# EAGLE design MAX31865_Layout_with_OLED (EAGLE 7.4.0)
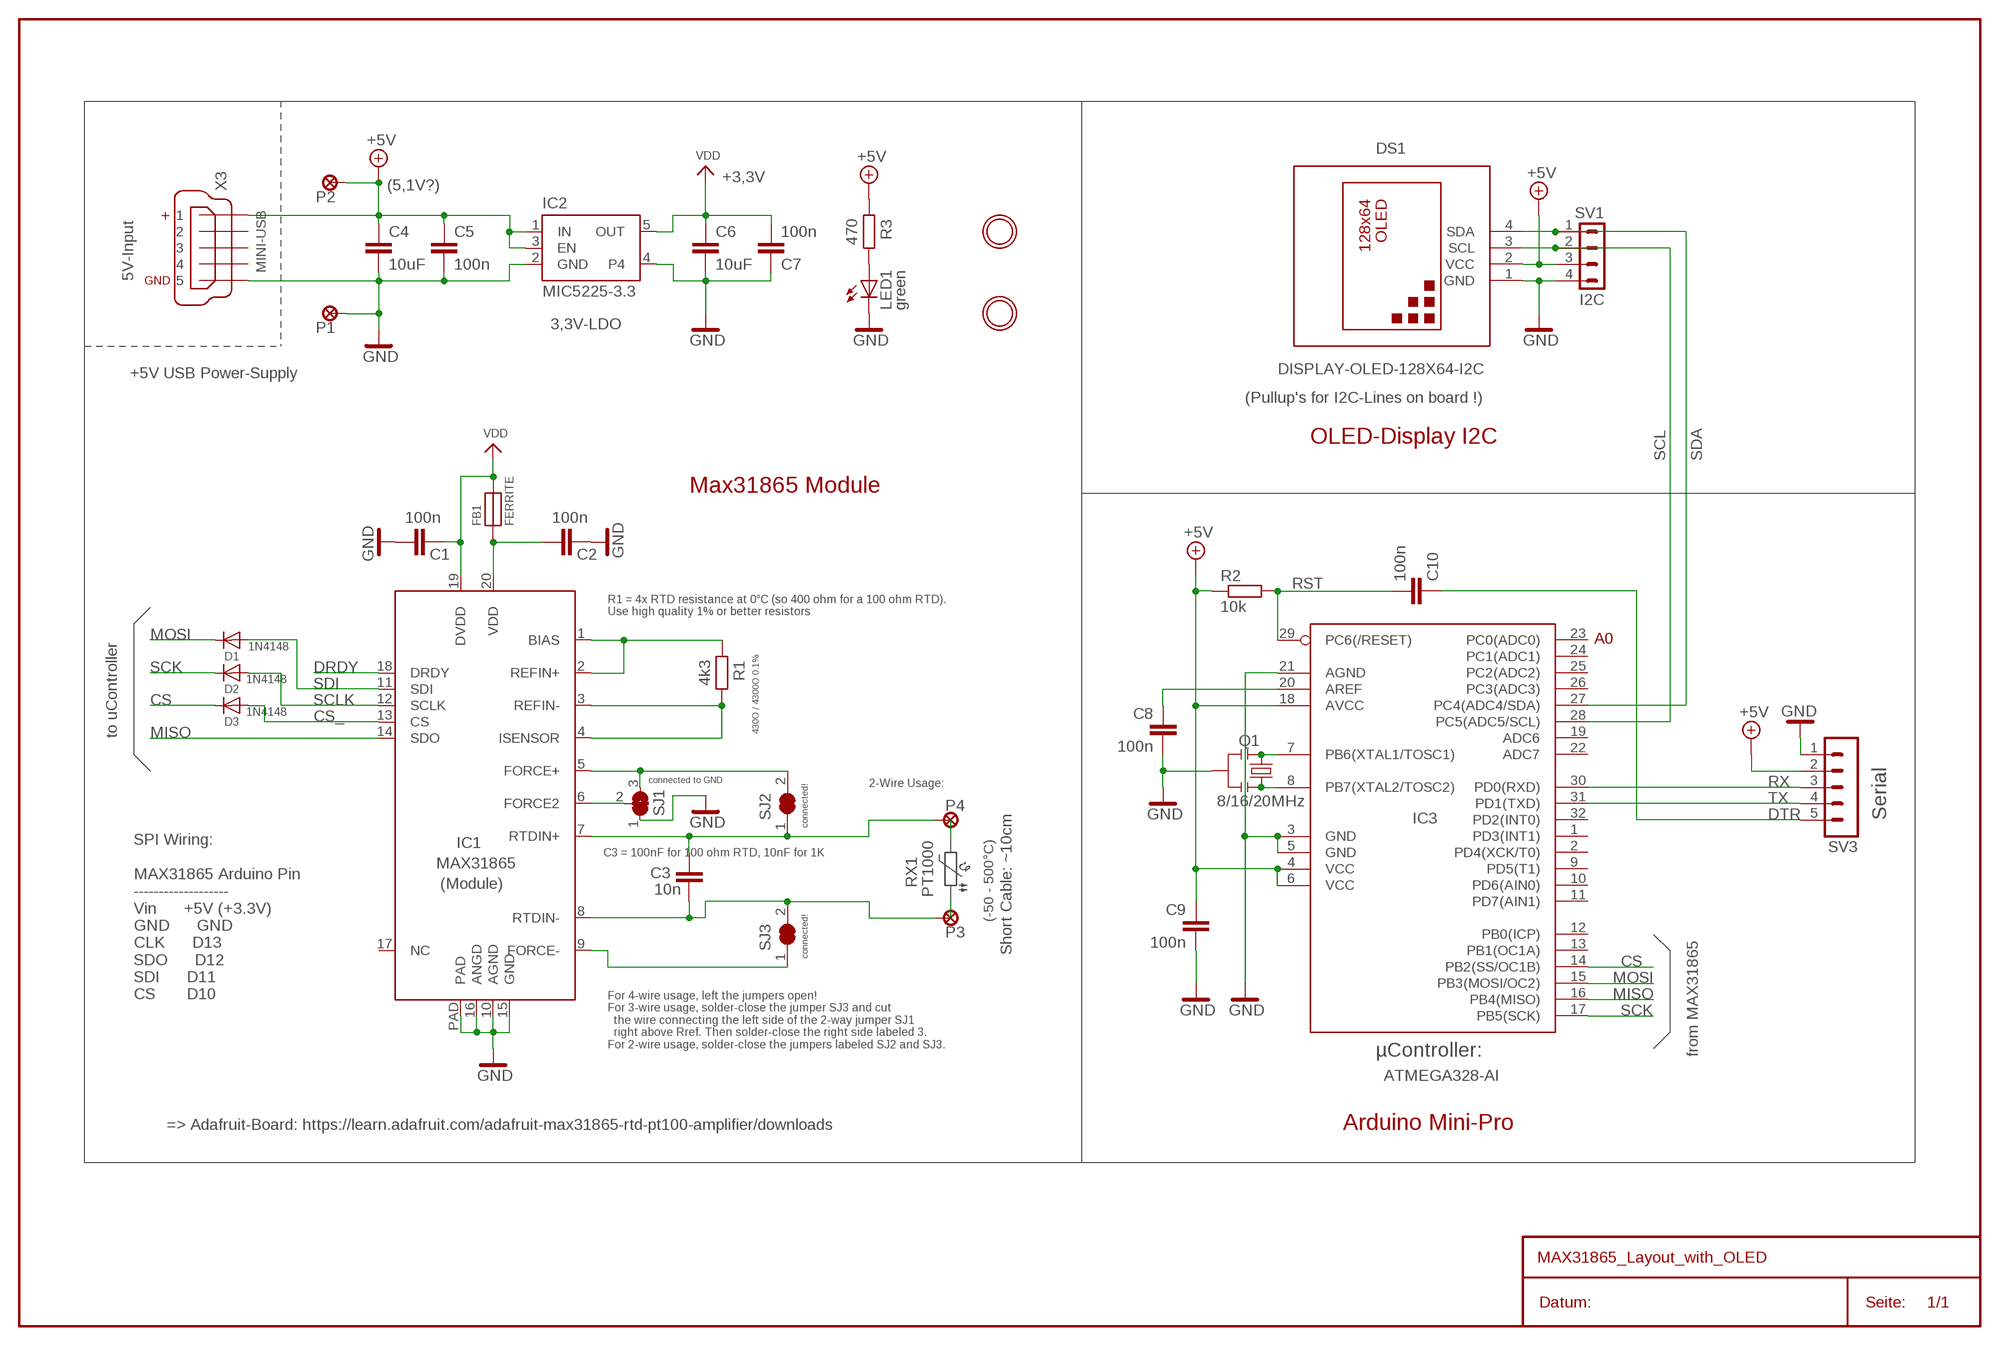
[diagram p0: schematic, sheet 1]

## Parts
C1  100n  C-EUC0603  [C0603]
C2  100n  C-EUC0603  [C0603]
C3  10n  C-EUC0603  [C0603]
C4  10uF  C-EUC0805  [C0805]
C5  100n  C-EUC0603  [C0603]
C6  10uF  C-EUC0603  [C0603]
C7  100n  C-EUC0603  [C0603]
C8  100n  C-EUC0603  [C0603]
C9  100n  C-EUC0603  [C0603]
C10  100n  C-EUC0603  [C0603]
D1  1N4148  DIODESOD-323  [SOD-323]
D2  1N4148  DIODESOD-323  [SOD-323]
D3  1N4148  DIODESOD-323  [SOD-323]
DS1  DISPLAY-OLED-128X64-I2C  [DISPLAY-OLED-128X64-I2C]
FB1  FERRITE  [0603]
IC1  MAX31865  TEMP_MAX31865  [QFN20_4MM_0.65MM]
IC2  MIC5225-3.3  VREG_SOT23-5  [SOT23-5]
IC3  ATMEGA328-AI  MEGA8-AI  [TQFP32-08]
LED1  green  LEDCHIPLED_0805  [CHIPLED_0805]
P1  LSP15  [LSP15]
P2  LSP15  [LSP15]
P3  LSP15  [LSP15]
P4  LSP15  [LSP15]
Q1  8/16/20MHz  RESONATOR1:1  [RESONATOR-SMD-1:1]
R1  4k3  R-EU_R0603  [R0603]
R2  10k  R-EU_R0603  [R0603]
R3  470  R-EU_R0603  [R0603]
SJ1  SOLDERJUMPER_2WAY  [SOLDERJUMPER_2WAY_OPEN_NOPASTE]
SJ2  SOLDERJUMPER  [SOLDERJUMPER_ARROW_NOPASTE]
SJ3  SOLDERJUMPER  [SOLDERJUMPER_ARROW_NOPASTE]
SV1  I2C  MA04-10  [MA04-1]
SV3  MA05-1  [MA05-1]
U$2  MOUNTINGHOLE2.5  [MOUNTINGHOLE_2.5_PLATED]
U$19  MOUNTINGHOLE2.5  [MOUNTINGHOLE_2.5_PLATED]
X3  MINI-USB  MINI-USB-32005-201  [32005-201]

## Nets
+5V: C4.1 C5.1 C9.1 DS1.2(VCC) IC2.1(IN) IC2.3(EN) IC3.4(VCC) IC3.6(VCC) IC3.18(AVCC) P2.P$1(MP) R2.1 R3.1 SV1.3 SV3.2 X3.1
AREF: C8.1 IC3.20(AREF)
CS: D3.C IC3.14(PB2(SS/OC1B))
CS_: D3.A IC1.13(CS)
DRDY: IC1.18(DRDY)
DTR: C10.1 SV3.5
FORCE2: IC1.6(FORCE2) SJ1.2
FORCE+: IC1.5(FORCE+) SJ1.3 SJ2.2
FORCE-: IC1.9(FORCE-) SJ3.1
GND: C1.2 C2.1 C4.2 C5.2 C6.2 C7.1 C8.2 C9.2 DS1.1(GND) IC1.10(AGND) IC1.15(GND) IC1.16(ANGD) IC1.PAD IC2.2(GND) IC2.4 IC3.3(GND) IC3.5(GND) IC3.21(AGND) LED1.C P1.P$1(MP) Q1.2 SJ1.1 SV1.4 SV3.1 X3.5
MISO: IC1.14(SDO) IC3.16(PB4(MISO))
MOSI: D1.C IC3.15(PB3(MOSI/OC2))
N$1: C2.2 FB1.1 IC1.20(VDD)
N$2: IC1.1(BIAS) IC1.2(REFIN+) R1.1
N$3: IC1.3(REFIN-) IC1.4(ISENSOR) R1.2
N$4: IC3.7(PB6(XTAL1/TOSC1)) Q1.1
N$5: IC3.8(PB7(XTAL2/TOSC2)) Q1.3
N$14: LED1.A R3.2
RST: C10.2 IC3.29(PC6(/RESET)) R2.2
RTDIN+: C3.1 IC1.7(RTDIN+) P4.P$1(MP) SJ2.1
RTDIN-: C3.2 IC1.8(RTDIN-) P3.P$1(MP) SJ3.2
RX: IC3.30(PD0(RXD)) SV3.3
SCK: D2.C IC3.17(PB5(SCK))
SCL: DS1.3(SCL) IC3.28(PC5(ADC5/SCL)) SV1.2
SCLK: D2.A IC1.12(SCLK)
SDA: DS1.4(SDA) IC3.27(PC4(ADC4/SDA)) SV1.1
SDI: D1.A IC1.11(SDI)
TX: IC3.31(PD1(TXD)) SV3.4
VDD: C1.1 C6.1 C7.2 FB1.2 IC1.19(DVDD) IC2.5(OUT)
Unconnected: IC1.17(NC) IC3.1(PD3(INT1)) IC3.2(PD4(XCK/T0)) IC3.9(PD5(T1)) IC3.10(PD6(AIN0)) IC3.11(PD7(AIN1)) IC3.12(PB0(ICP)) IC3.13(PB1(OC1A)) IC3.19(ADC6) IC3.22(ADC7) IC3.23(PC0(ADC0)) IC3.24(PC1(ADC1)) IC3.25(PC2(ADC2)) IC3.26(PC3(ADC3)) IC3.32(PD2(INT0)) X3.2 X3.3 X3.4

## Notes on the sheet
- +3,3V
- (5,1V?)
- 5V-Input
- 3,3V-LDO
- +5V USB Power-Supply
- (Pullup's for I2C-Lines on board !)
- OLED-Display I2C
- Max31865 Module
- R1 = 4x RTD resistance at 0°C (so 400 ohm for a 100 ohm RTD).
  Use high quality 1% or better resistors
- A0
- 430O / 4300O 0.1%
- to uController
- connected to GND
- 2-Wire Usage:
- Serial
- connected!
- C3 = 100nF for 100 ohm RTD, 10nF for 1K
- (Module)
- (-50 - 500°C)
- Short Cable: ~10cm
- connected!
- SPI Wiring:
  
  MAX31865 Arduino Pin
  -------------------
  Vin      +5V (+3.3V)
  GND      GND
  CLK      D13
  SDO      D12
  SDI      D11
  CS       D10
- For 4-wire usage, left the jumpers open!
  For 3-wire usage, solder-close the jumper SJ3 and cut
    the wire connecting the left side of the 2-way jumper SJ1
    right above Rref. Then solder-close the right side labeled 3.
  For 2-wire usage, solder-close the jumpers labeled SJ2 and SJ3.
- µController: | from MAX31865
- => Adafruit-Board: https://learn.adafruit.com/adafruit-max31865-rtd-pt100-amplifier/downloads | Arduino Mini-Pro

## Library data of the parts
C1-C10 = rcl1:C-EU: CAPACITOR, European symbol
D1-D3 = microbuilder:DIODE: Diode SMA Model Volts Amps Type Vf Ir Digikey # Notes SSA34-E3 40V 3A Schottky 480mV @ 3A 200uA @ 40V SSA34-E3/61TGITR-ND CDBA120-G 20V 1A Schottky 500mV @ 1A 500uA @ 20V 641-1014-6-ND REEL MBRA210 10V 2A Schottky 350mV @ 2A 700uA @ 10V MBRA210LT3 SOD-123 Model Volts Amps Type Vf Ir Order # Notes BAT54T1G 30V 200mA Schottky 800mV @ 200mA 2uA @ 25V BAT54T1GOSTR-ND B0530W 30V 500mA Schottky 430mV @ 500mA 130uA @ 30V B0530W-FDICT-ND REEL MBR120 20V 1A Schottky 340mV @ 1A MBR120VLSFT1GOSCT-ND SOD-323 Model Volts Amps Type Vf Ir Order # Notes PMEG2005EJ 20V 500mA Schottky 355mV @ 500mA 568-4110-1-ND ZLLS410 10V 570mA Schottky 380mV @ 570mA ZLLS410CT-ND 1N4148WS 75V 150mA Silicon/Simple 1V 1N4148WSFSCT-ND REEL SOD-523 Model Volts Amps Type Vf Ir Order # Notes BAT54XV2 30V 200mA Schottky 0.8V @ 100mA BAT54XV2CT-ND TB751S 30V 30mA Schottky RB751S-40TE61CT-ND SOT23-R/W (R = Solder Paste/Reflow Ovens, W = Hand-Soldering) Model Volts Amps Type Vf Ir Order # Notes BAT54FILM 40V 300mA Schottky 497-7162-1-ND POWERDI-5 Model Volts Amps Type Vf Ir Order # Notes PDS560 60V 5A Schottky 670mV @ 5A 150uA @ 60V PDS560DICT-ND
DS1 = diy-modules:DISPLAY-OLED-128X64-I2C: 128x64 Dot Matrix OLED Module based on SSD1306 chip Variant with I2C interface More details available here: http://www.instructables.com/id/Monochrome-096-i2c-OLED-display-with-arduino-SSD13/ SSD1306 datasheet: https://cdn-shop.adafruit.com/datasheets/SSD1306.pdf Click here to find device on ebay.com <http://www.ebay.com/sch/oled+display+128x64+iic> Note: There are two variants: I2C and SPI. Search for the proper version.
FB1 = microbuilder:FERRITE: Ferrite Bead 0603 MMZ1608B121C - 120 Ohm, 600mA Ferrite Chip - Digikey: 445-2164-1-ND BK1608HW121-T - 120 Ohm, 600mA Ferrite Chip - Digikey: 587-1876-2-ND 0805 HZ0805B272R-10 - 2.7K Ohm @ 100MHz, 200mA 0.8 Ohm DC Resistance - Digikey: 240-2504-1-ND (see also Murata BLM21BD272SN1L)
IC1 = microbuilder:TEMP_MAX31865: MAX31865 - Resistance to Digital Convertor for Platinum Resistance Temperature Detectors (RTDs) Handles 100 ohm - 1K ohm (at 0°C) platinum RTDs. 15-bit ADC resolution (nominally 0.03125°C), 0.5°C accuracy.
IC2 = microbuilder:VREG_SOT23-5: SOT23-5 Fixed Voltage Regulators Part Current Out V Out V In V Dropout θJA (°C/W) TJ (°C) Digikey Part No. ADP121 150mA 3.3V 3.4-5.5V 0.09V @ 150mA -- -- ADP121-AUJZ33R7CT-ND ADP121 150mA 3.0V 3.1-5.5V 0.09V @ 150mA -- -- ADP121-AUJZ30R7CT-ND ADP122 300mA 3.3V 3.4-5.5V 0.085V @ 300mA -- -- ADP122AUJZ-3.3-R7CT-ND ADP1712 300mA 3.3V 3.5-5.5V 0.17V @ 300mA -- -- ADP1712AUJZ-3.3-R7TR-ND AP7311 (Low Cost) 150mA 3.3V 3.5-6V 0.15V @ 150mA -- -- AP7311-33WG-7DICT-ND LD39015M18R 150mA 1.8V 1.9V-5.5V 0.08V @ 100mA -- -- 497-6977-1-ND LP2985A-33DBVR 150mA 3.3V 3.3-16V 0.28V @ 150mA 206 150 296-18479-1-ND MCP1824T-3302E/OT 300mA 3.3V 3.5V-6V 0.2V @ 300mA -- -- MCP1824T-3302E/OTCT-ND MIC5205-2.5YM5 TR 150mA 2.5V 2.7-16V 0.165V @ 150mA -- -- 576-1257-2-ND MIC5205-3.0YM5 TR 150mA 3.0V 3.2V-16V 0.165V @ 150mA -- -- 576-1258-2-ND MIC5205-3.3YM5 TR 150mA 3.3V 3.5V-16V 0.165V @ 150mA -- -- 576-1259-2-ND TPS780330220 150mA 3.3V+2.2V 3.6-5.5V 250mV Max -- -- 296-23332-1-ND TDA3663/N1,135 100mA 3.3V 3.5-45V 0.18V @ 50mA -- -- 568-5343-1-ND Max operating temp can be calculated using θJA, TJ (max junction temperature), and power in watts. Set the "Maximum Ambient Temperature" until it reaches TJ ("Max Junction Temperature"), which is the absolute limit for safe use of the regulator: Heat Sink Temperature Calculator <http://www.daycounter.com/Calculators/Heat-Sink-Temperature-Calculator.phtml> For example, With 12V source into a 3.3V LP2985 and a 30mA load, we are dissipating (12V-3.3V) * 0.03A = 0.261W. With a θJA of 206 °C/W, a TJ of 150°C, and 261mW we can safely use the chip without a heat sink up to 75°C (=147.1°C Junction Temperature).
IC3 = avr-7:MEGA8: MICROCONTROLLER 8 Kbytes FLASH 1 kbytes SRAM 512 bytes EEPROM USART 6-channel 10 bit ADC 2-channel 8 bit ADC
LED1 = led:LED: LED OSRAM: - CHIPLED LG R971, LG N971, LY N971, LG Q971, LY Q971, LO R971, LY R971 LH N974, LH R974 LS Q976, LO Q976, LY Q976 LO Q996 - Hyper CHIPLED LW Q18S LB Q993, LB Q99A, LB R99A - SideLED LS A670, LO A670, LY A670, LG A670, LP A670 LB A673, LV A673, LT A673, LW A673 LH A674 LY A675 LS A676, LA A676, LO A676, LY A676, LW A676 LS A679, LY A679, LG A679 - Hyper Micro SIDELED® LS Y876, LA Y876, LO Y876, LY Y876 LT Y87S - SmartLED LW L88C, LW L88S LB L89C, LB L89S, LG L890 LS L89K, LO L89K, LY L89K LS L896, LA L896, LO L896, LY L896 - TOPLED LS T670, LO T670, LY T670, LG T670, LP T670 LSG T670, LSP T670, LSY T670, LOP T670, LYG T670 LG T671, LOG T671, LSG T671 LB T673, LV T673, LT T673, LW T673 LH T674 LS T676, LA T676, LO T676, LY T676, LB T676, LH T676, LSB T676, LW T676 LB T67C, LV T67C, LT T67C, LS T67K, LO T67K, LY T67K, LW E67C LS E67B, LA E67B, LO E67B, LY E67B, LB E67C, LV E67C, LT E67C LW T67C LS T679, LY T679, LG T679 LS T770, LO T770, LY T770, LG T770, LP T770 LB T773, LV T773, LT T773, LW T773 LH T774 LS E675, LA E675, LY E675, LS T675 LS T776, LA T776, LO T776, LY T776, LB T776 LHGB T686 LT T68C, LB T68C - Hyper Mini TOPLED® LB M676 - Mini TOPLED Santana® LG M470 LS M47K, LO M47K, LY M47K Source: http://www.osram.convergy.de LUXEON: - LUMILED® LXK2-PW12-R00, LXK2-PW12-S00, LXK2-PW14-U00, LXK2-PW14-V00 LXK2-PM12-R00, LXK2-PM12-S00, LXK2-PM14-U00 LXK2-PE12-Q00, LXK2-PE12-R00, LXK2-PE12-S00, LXK2-PE14-T00, LXK2-PE14-U00 LXK2-PB12-K00, LXK2-PB12-L00, LXK2-PB12-M00, LXK2-PB14-N00, LXK2-PB14-P00, LXK2-PB14-Q00 LXK2-PR12-L00, LXK2-PR12-M00, LXK2-PR14-Q00, LXK2-PR14-R00 LXK2-PD12-Q00, LXK2-PD12-R00, LXK2-PD12-S00 LXK2-PH12-R00, LXK2-PH12-S00 LXK2-PL12-P00, LXK2-PL12-Q00, LXK2-PL12-R00 Source: www.luxeon.com KINGBRIGHT: KA-3528ASYC Source: www.kingbright.com
P1-P4 = solpad-smd:LSP15: SMD Solder-Pad (1.5mm Outer-Ø)
Q1 = Testing:RESONATOR: Resonator Small SMD resonator. This is the itty bitty 10/20MHz resonators with built in caps. CSTCE10M0G55 and CSTCE20M0V53. Footprint for SMD has been used in SFE production for years, and does work okay. 1:1 is an attempt to get larger fillets on the sides so it will be easier to inspect these solders in our AOI machine. The pads have been minimized to match the actual metal under the resonator. To see this relation, it includes an image import of the bottom side of the component. Imported to scale on layer 200.
R1-R3 = rcl1:R-EU_: RESISTOR, European symbol
SJ1 = microbuilder:SOLDERJUMPER_2WAY: 2-Way Solder Jumper
SJ2 SJ3 = microbuilder:SOLDERJUMPER: SMD Solder JUMPER Solder the two pads together to create a connection, or remove the solder to break it. REFLOW - Use this footprint for solder paste and reflow ovens. WAVE - Use this footprint for hand-soldering (larger pads). CLOSED - Has a trace between the two pads to ensure it is closed by default. The trace needs to be cut to disable the jumper, and can be closed again by creating a solder bridge between the two pads.; BOM: EXCLUDE
SV1 = con-lstc:MA04-1: PIN HEADER; OC_FARNELL: unknown; OC_NEWARK: unknown
SV3 = con-lstb:MA05-1: PIN HEADER
U$2 U$19 = microbuilder:MOUNTINGHOLE: Mounting Hole For #2 screws (0.086"/2.18mm width, 0.094"/2.4mm hole) use 2.5mm; BOM: EXCLUDE
X3 = con-cypressindustries:MINI-USB-: MINI USB-B Conector Source: www.cypressindustries.com; OC_FARNELL: unknown; OC_NEWARK: unknown

## Board
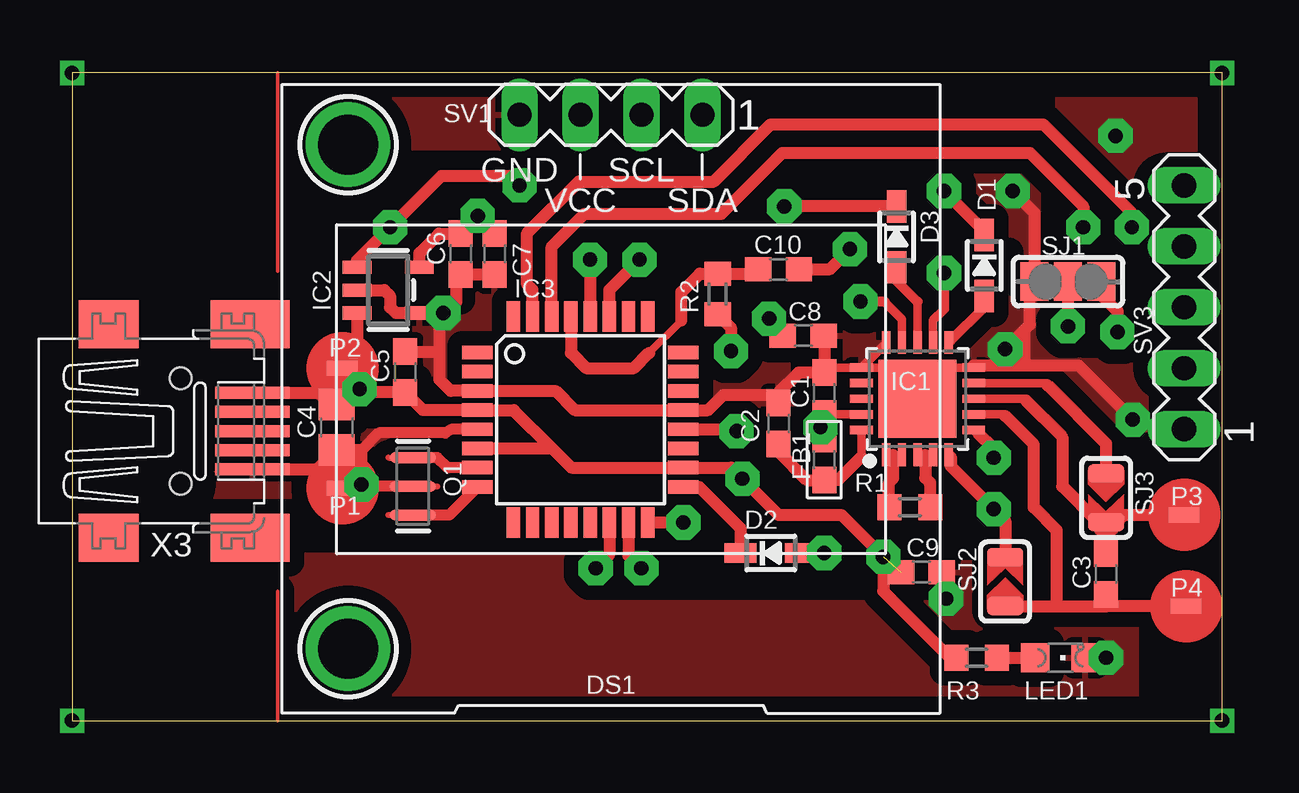
[diagram p1: board, top side]
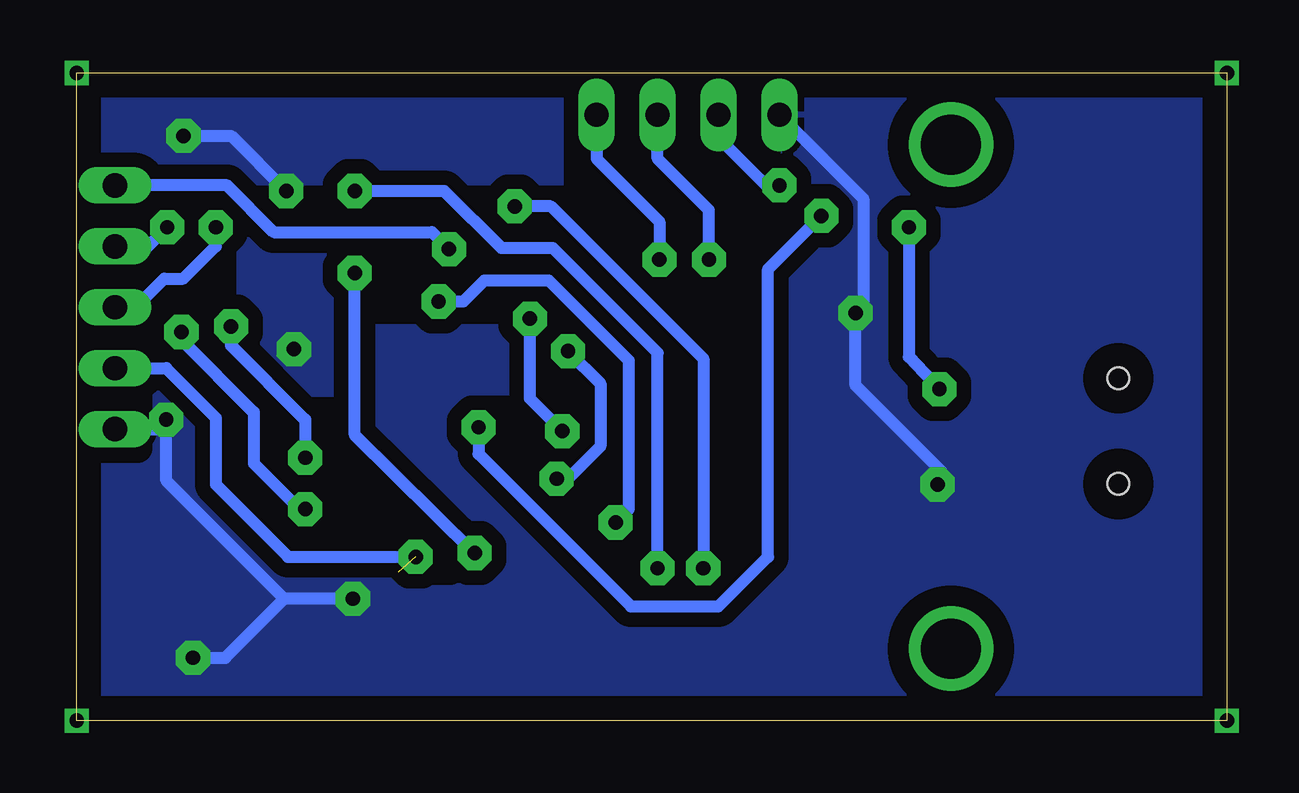
[diagram p2: board, bottom side, seen from below]

Size 47.94 x 26.99 mm. Coordinates in mm from the lower left corner, seen from the top.
Outline: 0,0 47.94,0 47.94,26.99 0,26.99 0,0
Copper layers (1*16): Top 0.035mm / dielectric 1.5mm / Bottom 0.035mm
Design rules "default": minimum track width 10mil, minimum drill 24mil, track to track 8mil, track to pad 8mil, pad to pad 8mil, via to via 8mil, smd to smd 8mil, copper to edge 40mil, drill to drill 8mil, minimum pad ring 10mil, minimum via ring 8mil, stop-mask expansion 4mil, vias tented up to drill 0mil, thermal gap 10mil
tRestrict: area 11.7,17.5 to 16.2,19.1; area 35.8,7.3 to 38.5,9.1; area 22.3,5.6 to 36.1,7.6; area 19.1,23.7 to 20.4,26.1; area 30.6,16.9 to 32.7,18.8; area 30.6,13.7 to 31.5,15.3; area 38.7,18.3 to 39.1,19.5; area 41,19.5 to 42.4,21.8; area 45.5,9.7 to 47.6,14.5; area 43.6,11 to 46,11.4; area 42.2,15.7 to 44.4,16; area 11.8,12.8 to 15,13.7; 7 more areas
bRestrict: area 41.9,17.1 to 43.7,20.4; area 30,17.1 to 35.7,19.6; area 29.6,10.7 to 31,12.9; area 37.1,11.4 to 38.4,12.9; area 45.4,11.4 to 47.1,14; area 32.4,6.3 to 33.9,7.3; area 19.2,23.7 to 21,26.4; area 26.7,20.8 to 41.1,21.7; area 26.5,21.4 to 27,24.4

### Footprints (pad centres in the part's own frame; a part is rotated, then mirrored left to right if it is on the bottom)
C0603 = smd 1.1 x 1: 1 -0.85,0; 2 0.85,0
C0805 = smd 1.3 x 1.5: 1 -0.95,0; 2 0.95,0
SOD-323 = smd 1.35 x 0.8: A 1.27,0; C -1.27,0
DISPLAY-OLED-128X64-I2C = drill 1 square: 1 -3.81,12.7 | drill 1: 2 -1.27,12.7; 3 1.27,12.7; 4 3.81,12.7
0603 = smd 1.1 x 1: 1 -0.85,0; 2 0.85,0
QFN20_4MM_0.65MM = smd 0.35 x 0.95: 1 -1.3,-2.34; 2 -0.65,-2.34; 3 0,-2.34; 4 0.65,-2.34; 5 1.3,-2.34; 11 1.3,2.34; 12 0.65,2.34; 13 0,2.34; 14 -0.65,2.34; 15 -1.3,2.34 | smd 0.95 x 0.35: 6 2.34,-1.3; 7 2.34,-0.65; 8 2.34,0; 9 2.34,0.65; 10 2.34,1.3; 16 -2.34,1.3; 17 -2.34,0.65; 18 -2.34,0; 19 -2.34,-0.65; 20 -2.34,-1.3 | smd 3.25 x 3.25: PAD 0,0
SOT23-5 = smd 0.55 x 1.2: 1 -0.95,-1.3; 2 0,-1.3; 3 0.95,-1.3; 4 0.95,1.3; 5 -0.95,1.3
TQFP32-08 = smd 1.27 x 0.559: 1 -4.293,2.8; 2 -4.293,2; 3 -4.293,1.2; 4 -4.293,0.4; 5 -4.293,-0.4; 6 -4.293,-1.2; 7 -4.293,-2; 8 -4.293,-2.8; 17 4.293,-2.8; 18 4.293,-2; 19 4.293,-1.2; 20 4.293,-0.4; 21 4.293,0.4; 22 4.293,1.2; 23 4.293,2; 24 4.293,2.8 | smd 0.559 x 1.27: 9 -2.8,-4.293; 10 -2,-4.293; 11 -1.2,-4.293; 12 -0.4,-4.293; 13 0.4,-4.293; 14 1.2,-4.293; 15 2,-4.293; 16 2.8,-4.293; 25 2.8,4.293; 26 2,4.293; 27 1.2,4.293; 28 0.4,4.293; 29 -0.4,4.293; 30 -1.2,4.293; 31 -2,4.293; 32 -2.8,4.293
CHIPLED_0805 = smd 1.2 x 1.2: A 0,-1.05; C 0,1.05
LSP15 = smd 1.27 x 0.635: P$1 0,0
RESONATOR-SMD-1:1 = smd 0.45 x 1.905: 1 -1.2,0; 2 0,0; 3 1.2,0
R0603 = smd 1 x 1.1: 1 -0.85,0; 2 0.85,0
SOLDERJUMPER_2WAY_OPEN_NOPASTE = smd 1.168 x 1.6: 1 -1.397,0; 2 0,0; 3 1.397,0
SOLDERJUMPER_ARROW_NOPASTE = smd 0.762 x 1.524: 1 -1.016,0; 2 1.016,0
MA04-1 = drill 0.635 pad 1.524 long: 1 -3.81,0; 2 -1.27,0; 3 1.27,0; 4 3.81,0
MA05-1 = drill 1.016 long: 1 -5.08,0; 2 -2.54,0; 3 0,0; 4 2.54,0; 5 5.08,0
MOUNTINGHOLE_2.5_PLATED = drill 2.5 pad 3.2: P$1 0,0
32005-201 = smd 3.1 x 0.5: 1 3,1.6; 2 3,0.8; 3 3,0; 4 3,-0.8; 5 3,-1.6 | smd 2.5 x 2: M1 -3,-4.45; M2 -3,4.45 | smd 3.3 x 2: M3 2.9,4.45; M4 2.9,-4.45 | hole 0.9: 0,2.2; 0,-2.2

### Placement (x,y rotation side)
C1  31.35,13.65 90 top
C2  29.45,12.38 270 top
C3  43.1,6.11 90 top
C4  11.03,12.22 270 top
C5  13.89,14.53 90 top
C6  16.19,19.45 270 top
C7  17.62,19.45 90 top
C8  30.48,16.03 0 top
C9  35.4,6.19 0 top
C10  29.45,18.81 180 top
D1  38.02,18.97 270 top
D2  29.13,6.99 0 top
D3  34.37,20.16 270 top
DS1  22.46,12.54 0 top
FB1  31.35,10.87 90 top
IC1  35.24,13.41 0 top
IC2  13.18,17.94 270 top
IC3  21.19,12.54 0 top
LED1  41.2,2.62 270 top
P1  11.27,9.68 0 top
P2  11.27,14.68 0 top
P3  46.35,8.57 0 top
P4  46.43,4.76 0 top
Q1  14.21,9.76 270 top
R1  34.92,8.89 0 top
R2  26.91,17.78 90 top
R3  37.7,2.62 0 top
SJ1  41.51,18.3 0 top
SJ2  38.89,5.79 90 top
SJ3  43.1,9.29 270 top
SV1  22.46,25.24 180 top
SV3  46.35,17.22 90 top
U$2  11.5,3 0 top
U$19  11.5,24 0 top
X3  4.52,12.06 0 top

### Tracks (layer width: path | path; a pad name or v marks a point on that pad's centre or on a via)
+5V  (via drill 0.6 pad 1.42)  (1 unrouted)
  Top 0.508: 20,11.35 18.41,12.94 IC3.4 14.62,12.94 C5.1 12.09,13.68 v11.99,13.81 | IC3.6 19.99,11.34 20,11.35 | R2.1 27.46,16.37 v27.46,15.4 | v18.65,22.3 18.26,22.7 15.4,22.7 v13.26,20.56 11.88,19.18 IC2.1 | X3.1 10.22,13.66 C4.1 10.72,13.65 11.19,13.81 | 11.19,13.81 v11.99,13.81 | IC2.3 11.88,14.08 v11.99,13.81 | 20,11.35 20.81,10.54 IC3.18 27.48,10.54 v27.94,10.08 29.45,8.57 32.07,8.57 v33.81,6.83 33.81,5.4 36.59,2.62 R3.1 | P2.P$1 11.27,13.73 11.19,13.81
  Bottom 0.508: SV1.3 21.19,24.29 19.21,22.3 v18.65,22.3 | v27.46,15.4 26.11,14.05 26.11,11.43 27.46,10.08 v27.94,10.08 | SV3.2 44.21,14.68 42.15,12.62 42.15,9.84 39.13,6.83 v33.81,6.83 | v13.26,20.56 13.26,15.16 v11.99,13.81
AREF  (via drill 0.6 pad 1.42)
  Top 0.508: IC3.20 27.62,12.14 v27.7,12.06 | C8.1 29.53,15.95 29.53,16.19 v29.05,16.75
  Bottom 0.508: v27.7,12.06 29.05,13.41 v29.05,16.75
CS  (via drill 0.6 pad 1.42)
  Top 0.508: IC3.14 22.39,6.92 v21.83,6.35 | D3.C v29.69,21.43
  Bottom 0.508: v21.83,6.35 21.83,15.08 28.18,21.43 v29.69,21.43
CS_
  Top 0.356: IC1.13 35.24,17.46
  Top 0.406: 35.24,17.46 34.37,18.34 D3.A
DTR  (via drill 0.6 pad 1.42)
  Top 0.508: C10.1 31.59,18.81 v32.42,19.64
  Bottom 0.508: v32.42,19.64 33.14,20.36 39.73,20.36 41.67,22.3 SV3.5
FORCE2  (via drill 0.6 pad 1.42)
  Top 0.33: IC1.6 37.74,12.03
  Top 0.508: SJ1.2 v41.51,16.43 | 37.74,12.03 38.42,11.35 v38.42,10.95
  Bottom 0.508: v38.42,10.95 38.42,12.54 41.51,15.64 v41.51,16.43
FORCE+  (via drill 0.6 pad 1.42)
  Top 0.33: IC1.5 36.62,10.99
  Top 0.508: 36.62,10.99 36.62,10.61 v38.42,8.81 38.89,8.33 SJ2.2 | SJ1.3 42.91,17.73 43.58,17.07 v43.58,16.19
  Bottom 0.508: v38.42,8.81 38.66,8.81 40.56,10.72 40.56,12.86 43.58,15.88 v43.58,16.19
FORCE-
  Top 0.356: IC1.9 40.66,14.06 40.67,13.97
  Top 0.508: 43.1,10.35 SJ3.1 43.1,11.54 40.67,13.97
GND  (via drill 0.6 pad 1.42)
  Top 0.356: IC1.16 31.57,14.71 | IC1.16 IC1.15 | 33.94,14.71 IC1.16 | 36.54,14.71 IC1.10 37.58,14.8
  Top 0.406: 31.57,14.71 C1.2 | 14.22,9.76 Q1.2 | 12.14,9.76 v12.06,9.84
  Top 0.457: IC3.5 15.8,12.14 15.56,11.99 12.78,11.99 12.07,11.27 | Q1.2 12.14,9.76
  Top 0.508: IC2.2 13.02,17.94 13.26,17.7 13.26,17.22 13.49,16.99 IC2.4 | C7.1 C6.2 16.01,18.89 16.01,17.44 v15.48,16.99 15.32,16.99 15.16,16.99 | 33.94,14.71 IC1.PAD 36.54,14.71 | 29.45,13.65 30.3,14.5 C1.2 31.35,16.01 C8.2 | 29.45,13.65 C2.1 | 29.45,13.65 29.37,13.57 27.15,13.57 26.51,12.94 IC3.21 20.95,12.94 20.15,13.74 IC3.3 15.79,13.74 15.32,14.21 15.32,15.38 | C9.2 36.25,5.26 v36.43,5.08 | v44.21,12.54 41.95,14.8 39.69,14.8 | 37.58,14.8 39.69,14.8 | 39.69,16.27 39.69,14.8 | IC2.4 15.16,16.99 | 14.21,16.99 IC2.4 | 15.32,15.38 15.32,16.83 15.16,16.99 | X3.5 10.22,10.46 C4.2 | C5.2 15.32,15.38 | C4.2 | 12.07,11.27 12.06,11.27 | 12.06,11.27 C4.2 | 12.06,11.27 v12.06,9.84 11.27,9.84 P1.P$1 | 39.69,16.27 v38.89,15.48 | 39.69,16.27 39.93,16.51 39.93,18.11 SJ1.1 40.12,21.16 v39.21,22.07 | LED1.C v43.1,2.62
  Bottom 0.508: SV1.4 15.16,21.75 15.16,17.3 v15.48,16.99 15.48,13.97 11.91,10.4 v12.06,9.84 | v36.43,5.08 39.29,5.08 | 44.21,12.14 44.21,10 39.29,5.08 | 44.21,12.14 v44.21,12.54 | SV3.1 44.21,12.14 | v43.5,24.37 41.51,24.37 v39.21,22.07 | v43.1,2.62 41.75,2.62 39.29,5.08
  pour Bottom (isolate 0.61): -0.32,27.3 48.26,27.3 48.26,-0.32 -0.32,-0.32
  pour Top (isolate 0.61): -0.32,27.3 48.26,27.3 48.26,-0.32 -0.32,-0.32
MISO  (via drill 0.6 pad 1.42)
  Top 0.356: IC1.14 34.59,16.73 33.86,17.46
  Top 0.406: v25.48,8.26 v25.47,8.25 | 33.86,17.46 v32.86,17.46
  Top 0.508: v25.47,8.25 IC3.16
  Bottom 0.508: v25.48,8.26 24.92,8.81 24.92,15 28.26,18.34 30.96,18.34 31.83,17.46 v32.86,17.46
MOSI  (via drill 0.6 pad 1.42)
  Top 0.508: IC3.15 23.19,6.89 v23.73,6.35 | v36.35,22.07 38.02,20.4 D1.C
  Bottom 0.508: v23.73,6.35 23.73,15.32 28.1,19.68 30.24,19.68 32.62,22.07 v36.35,22.07
N$1
  Top 0.356: IC1.20 32.9,10.99
  Top 0.508: 32.9,10.99 31.93,10.02 FB1.1 30.64,10.02 29.45,11.21 C2.2
N$2
  Top 0.33: IC1.1 34.23,11.07 IC1.2
  Top 0.508: R1.1 34.05,9.92 34.23,10.1 34.23,11.07
N$3
  Top 0.33: IC1.4 35.56,11.07 IC1.3
  Top 0.508: 35.56,11.07 35.56,10.12 35.76,9.92 35.76,9.53 R1.2
N$4
  Top 0.457: IC3.7 15.65,10.54 15.22,10.96 Q1.1
N$5
  Top 0.457: Q1.3 15.72,8.56 IC3.8
N$6  (via drill 0.6)
  other vias: 0,0
N$7  (via drill 0.6)
  other vias: 0,26.99
N$8  (via drill 0.6)
  other vias: 47.94,26.99
N$9  (via drill 0.6)
  other vias: 47.94,0
N$10
  Top 0.152: 8.57,26.99 8.57,18.73
N$11
  Top 0.152: 8.57,5.4 8.57,0
N$14
  Top 0.508: R3.2 LED1.A
RST
  Top 0.305: 24.05,15.32 25.4,16.67
  Top 0.508: IC3.29 20.79,15.32 21.43,14.68 23.42,14.68 24.05,15.32 | 25.4,16.67 25.4,17.86 26.17,18.63 R2.2 28.42,18.63 C10.2
RTDIN+
  Top 0.356: IC1.7 38.83,12.76 38.89,12.7
  Top 0.508: P4.P$1 43.1,4.76 | 43.1,4.76 C3.1 | SJ2.1 39.05,4.76 41.04,4.76 | 41.04,4.76 43.1,4.76 | 41.04,4.76 41.04,7.94 40.08,8.89 40.08,11.51 38.89,12.7
RTDIN-
  Top 0.356: IC1.8 39.69,13.41 39.77,13.34
  Top 0.508: 42.85,7.95 SJ3.2 | SJ3.2 43.35,7.95 43.81,8.57 P3.P$1 | C3.2 SJ3.2 | SJ3.2 42.77,8.27 41.27,9.76 41.27,11.83 39.77,13.34
RX  (via drill 0.6 pad 1.42)
  Top 0.508: IC3.30 19.99,19.75 21.35,21.11 27.07,21.11 29.61,23.65 39.93,23.65 42.15,21.43 v42.15,20.56
  Bottom 0.508: SV3.3 45.48,17.22 44.29,18.41 43.5,18.41 42.15,19.76 v42.15,20.56
SCK
  Top 0.508: IC3.17 26.14,9.74 27.86,8.02 D2.C
SCL  (via drill 0.6 pad 1.42)
  Top 0.508: v21.59,19.21 21.59,18.65 IC3.28
  Bottom 0.508: v21.59,19.21 21.59,21.27 23.73,23.42 SV1.2
SCLK  (via drill 0.6 pad 1.42)
  Top 0.356: IC1.12 35.89,16.68 36.35,17.14
  Top 0.406: 36.35,17.14 v36.35,18.65
  Top 0.508: D2.A v31.35,6.99
  Bottom 0.508: v36.35,18.65 36.35,11.91 v31.35,6.99
SDA  (via drill 0.6 pad 1.42)
  Top 0.508: IC3.27 22.39,17.95 v23.65,19.21
  Bottom 0.508: SV1.1 26.27,23.42 23.65,20.8 v23.65,19.21
SDI
  Top 0.356: IC1.11 36.59,15.8
  Top 0.406: D1.A 38.02,17.23 36.59,15.8
TX  (via drill 0.6 pad 1.42)
  Top 0.508: IC3.31 19.19,17.95 18.97,18.18 18.97,20.32 21.11,22.46 26.75,22.46 29.13,24.84 40.48,24.84 44.17,21.15 v44.17,20.56
  Bottom 0.508: v44.17,20.56 44.97,19.76 SV3.4
VDD  (via drill 0.6 pad 1.42)
  Top 0.356: IC1.19 31.39,12.76
  Top 0.406: 31.39,12.76 C1.1 FB1.2
  Top 0.508: C7.2 16.91,21.01 | 16.91,21.01 v16.91,21.03 | 16.91,21.01 C6.1 15.3,20.3 14.48,19.48 IC2.5 | FB1.2 31.35,12.06 v31.19,12.22
  Bottom 0.508: v31.19,12.22 31.19,11.11 24.84,4.76 21.19,4.76 19.13,6.83 19.13,18.81 v16.91,21.03

### Text on the board
tValues: Serial | +5V | GND | PT1000